# Altium schematic sheet Current_Kill.SchDoc
size A
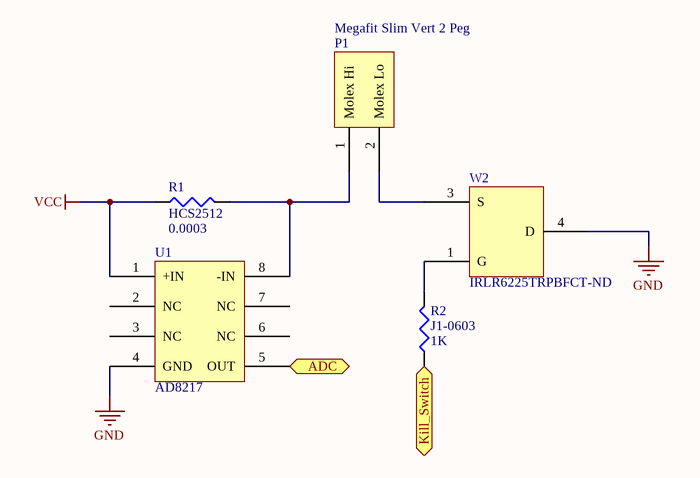
[diagram p0: Current_Kill.SchDoc]

## Parts
P1  Megafit Slim Vert 2 Peg  [76829-0102]
R1  HCS2512  value 0.0003  [HCS2512FTL300CT-ND_DT]
R2  J1-0603  value 1K  [J1-0603]
U1  AD8217  [AD8217_DT]
W2  IRLR6225TRPBFCT-ND  [IRLR6225_DT]

## Ports
ADC (out), Kill_Switch (in)

## Nets
GND: U1.4(GND) W2.4(D)
VCC: R1.1 U1.1(+IN)
ADC: U1.5(OUT) ; port ADC
Kill_Switch: R2.1 ; port Kill_Switch
NetP1_1: P1.1(Molex_Hi) R1.2 U1.8(-IN)
NetP1_2: P1.2(Molex_Lo) W2.3(S)
NetR2_2: R2.2 W2.1(G)

Not connected (* = marked no-connect by the designer): U1 2(NC) 3(NC) 6(NC) 7(NC)

## Library data of the parts
R1 = Res3: Resistor; mfgr_part_num: HCS2512FTL300; Published: 8-Jun-2000; LatestRevisionDate: 29-May-2009; LatestRevisionNote: IPC-7351 Footprint Added.; PackageReference: J1-0603; Publisher: Altium Limited; PackageDescription: Chip Resistor
R2 = Res3: Resistor; Published: 8-Jun-2000; LatestRevisionDate: 29-May-2009; LatestRevisionNote: IPC-7351 Footprint Added.; PackageReference: J1-0603; Publisher: Altium Limited; PackageDescription: Chip Resistor
U1 = AD8217: mfgr_part_num: AD8217BRMZ-R7
P1 = Megafit Slim Vert 2 Peg: mfgr_part_num: 76829-0102
W2 = IRLR6225TRPBFCT-ND: mnfr_part_num: IRLR6225TRPBF